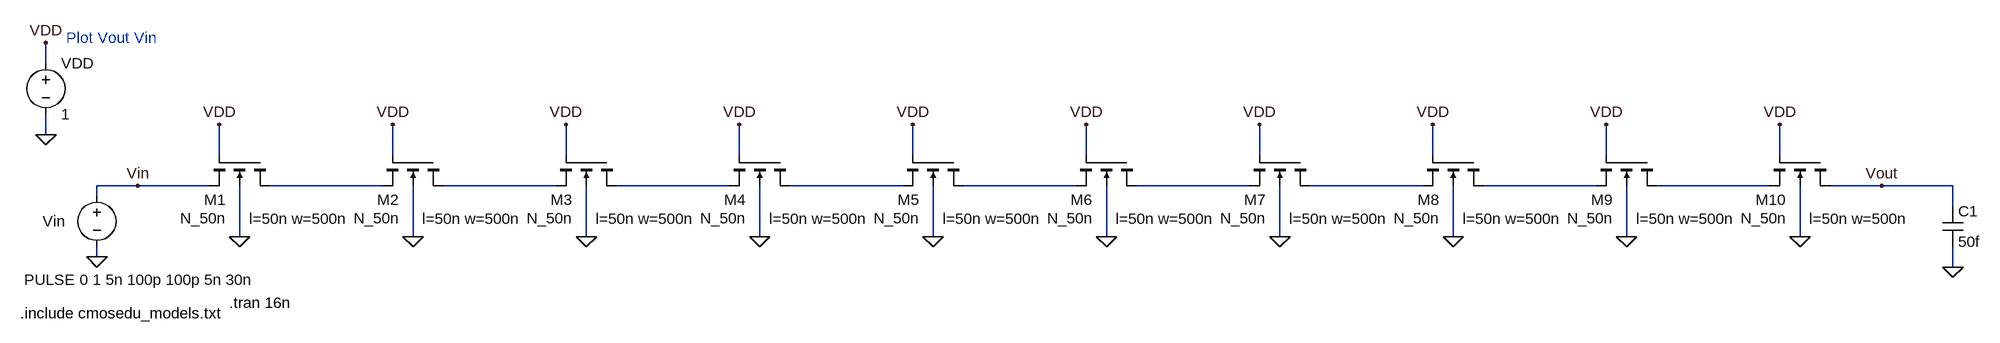
[diagram p0: schematic Fig10_23.asc]
Fig10_23.asc, the LTspice schematic file:
Version 4
SHEET 1 3168 680
WIRE 128 -304 128 -336
WIRE 128 -192 128 -224
WIRE 400 -160 400 -208
WIRE 672 -160 672 -208
WIRE 944 -160 944 -208
WIRE 1216 -160 1216 -208
WIRE 1488 -160 1488 -208
WIRE 1760 -160 1760 -208
WIRE 2032 -160 2032 -208
WIRE 2304 -160 2304 -208
WIRE 2576 -160 2576 -208
WIRE 2848 -160 2848 -208
WIRE 272 -112 208 -112
WIRE 384 -112 272 -112
WIRE 656 -112 480 -112
WIRE 928 -112 752 -112
WIRE 1200 -112 1024 -112
WIRE 1472 -112 1296 -112
WIRE 1744 -112 1568 -112
WIRE 2016 -112 1840 -112
WIRE 2288 -112 2112 -112
WIRE 2560 -112 2384 -112
WIRE 2832 -112 2656 -112
WIRE 3008 -112 2928 -112
WIRE 3120 -112 3008 -112
WIRE 208 -96 208 -112
WIRE 3120 -80 3120 -112
WIRE 432 -32 432 -112
WIRE 704 -32 704 -112
WIRE 976 -32 976 -112
WIRE 1248 -32 1248 -112
WIRE 1520 -32 1520 -112
WIRE 1792 -32 1792 -112
WIRE 2064 -32 2064 -112
WIRE 2336 -32 2336 -112
WIRE 2608 -32 2608 -112
WIRE 2880 -32 2880 -112
WIRE 208 0 208 -16
WIRE 3120 16 3120 -16
FLAG 208 0 0
FLAG 3120 16 0
FLAG 3008 -112 Vout
FLAG 272 -112 Vin
FLAG 432 -32 0
FLAG 128 -192 0
FLAG 400 -208 VDD
FLAG 128 -336 VDD
FLAG 704 -32 0
FLAG 672 -208 VDD
FLAG 976 -32 0
FLAG 944 -208 VDD
FLAG 1248 -32 0
FLAG 1216 -208 VDD
FLAG 1520 -32 0
FLAG 1488 -208 VDD
FLAG 1792 -32 0
FLAG 1760 -208 VDD
FLAG 2064 -32 0
FLAG 2032 -208 VDD
FLAG 2336 -32 0
FLAG 2304 -208 VDD
FLAG 2608 -32 0
FLAG 2576 -208 VDD
FLAG 2880 -32 0
FLAG 2848 -208 VDD
SYMBOL nmos4 480 -160 R90
WINDOW 0 70 70 VRight 0
WINDOW 3 99 70 VRight 0
WINDOW 123 100 -119 VRight 0
SYMATTR InstName M1
SYMATTR Value N_50n
SYMATTR Value2 l=50n w=500n
SYMBOL voltage 208 -112 R0
WINDOW 0 -85 56 Left 0
WINDOW 3 -114 148 Left 0
WINDOW 123 0 0 Left 0
WINDOW 39 0 0 Left 0
SYMATTR InstName Vin
SYMATTR Value PULSE 0 1 5n 100p 100p 5n 30n
SYMBOL cap 3104 -80 R0
SYMATTR InstName C1
SYMATTR Value 50f
SYMBOL voltage 128 -320 R0
WINDOW 123 0 0 Left 0
WINDOW 39 0 0 Left 0
SYMATTR InstName VDD
SYMATTR Value 1
SYMBOL nmos4 752 -160 R90
WINDOW 0 70 70 VRight 0
WINDOW 3 99 70 VRight 0
WINDOW 123 100 -119 VRight 0
SYMATTR InstName M2
SYMATTR Value N_50n
SYMATTR Value2 l=50n w=500n
SYMBOL nmos4 1024 -160 R90
WINDOW 0 70 70 VRight 0
WINDOW 3 99 70 VRight 0
WINDOW 123 100 -119 VRight 0
SYMATTR InstName M3
SYMATTR Value N_50n
SYMATTR Value2 l=50n w=500n
SYMBOL nmos4 1296 -160 R90
WINDOW 0 70 70 VRight 0
WINDOW 3 99 70 VRight 0
WINDOW 123 100 -119 VRight 0
SYMATTR InstName M4
SYMATTR Value N_50n
SYMATTR Value2 l=50n w=500n
SYMBOL nmos4 1568 -160 R90
WINDOW 0 70 70 VRight 0
WINDOW 3 99 70 VRight 0
WINDOW 123 100 -119 VRight 0
SYMATTR InstName M5
SYMATTR Value N_50n
SYMATTR Value2 l=50n w=500n
SYMBOL nmos4 1840 -160 R90
WINDOW 0 70 70 VRight 0
WINDOW 3 99 70 VRight 0
WINDOW 123 100 -119 VRight 0
SYMATTR InstName M6
SYMATTR Value N_50n
SYMATTR Value2 l=50n w=500n
SYMBOL nmos4 2112 -160 R90
WINDOW 0 70 70 VRight 0
WINDOW 3 99 70 VRight 0
WINDOW 123 100 -119 VRight 0
SYMATTR InstName M7
SYMATTR Value N_50n
SYMATTR Value2 l=50n w=500n
SYMBOL nmos4 2384 -160 R90
WINDOW 0 70 70 VRight 0
WINDOW 3 99 70 VRight 0
WINDOW 123 100 -119 VRight 0
SYMATTR InstName M8
SYMATTR Value N_50n
SYMATTR Value2 l=50n w=500n
SYMBOL nmos4 2656 -160 R90
WINDOW 0 70 70 VRight 0
WINDOW 3 99 70 VRight 0
WINDOW 123 100 -119 VRight 0
SYMATTR InstName M9
SYMATTR Value N_50n
SYMATTR Value2 l=50n w=500n
SYMBOL nmos4 2928 -160 R90
WINDOW 0 70 70 VRight 0
WINDOW 3 99 70 VRight 0
WINDOW 123 100 -119 VRight 0
SYMATTR InstName M10
SYMATTR Value N_50n
SYMATTR Value2 l=50n w=500n
TEXT 416 72 Left 0 !.tran 16n
TEXT 88 88 Left 0 !.include cmosedu_models.txt
TEXT 160 -344 Left 0 ;Plot Vout Vin

The netlist it stands for:
* Fig10_23.asc
M1 N001 VDD Vin 0 N_50n l=50n w=500n
Vin Vin 0 PULSE 0 1 5n 100p 100p 5n 30n
C1 Vout 0 50f
VDD VDD 0 1
M2 N002 VDD N001 0 N_50n l=50n w=500n
M3 N003 VDD N002 0 N_50n l=50n w=500n
M4 N004 VDD N003 0 N_50n l=50n w=500n
M5 N005 VDD N004 0 N_50n l=50n w=500n
M6 N006 VDD N005 0 N_50n l=50n w=500n
M7 N007 VDD N006 0 N_50n l=50n w=500n
M8 N008 VDD N007 0 N_50n l=50n w=500n
M9 N009 VDD N008 0 N_50n l=50n w=500n
M10 Vout VDD N009 0 N_50n l=50n w=500n
.model NMOS NMOS
.model PMOS PMOS
.lib standard.mos
.tran 16n
.include cmosedu_models.txt
* Plot Vout Vin
.backanno
.end